# Altium schematic sheet RP2040_Evaluation_Connectors.SchDoc: RP2040 Evaluation Board
size B; Date: 6/27/21; Author: Robert Pafford; Organization: ORGANIZATION; Address1: ADDRESS 1; Address2: ADDRESS 2; Address3: ADDRESS 3; Address4: ADDRESS 4; Revision: -; SheetNumber: 2; SheetTotal: 3; ENG_APP_DATE: --/--/--; DSN_APP_DATE: --/--/--; CHK_APP_DATE: --/--/--
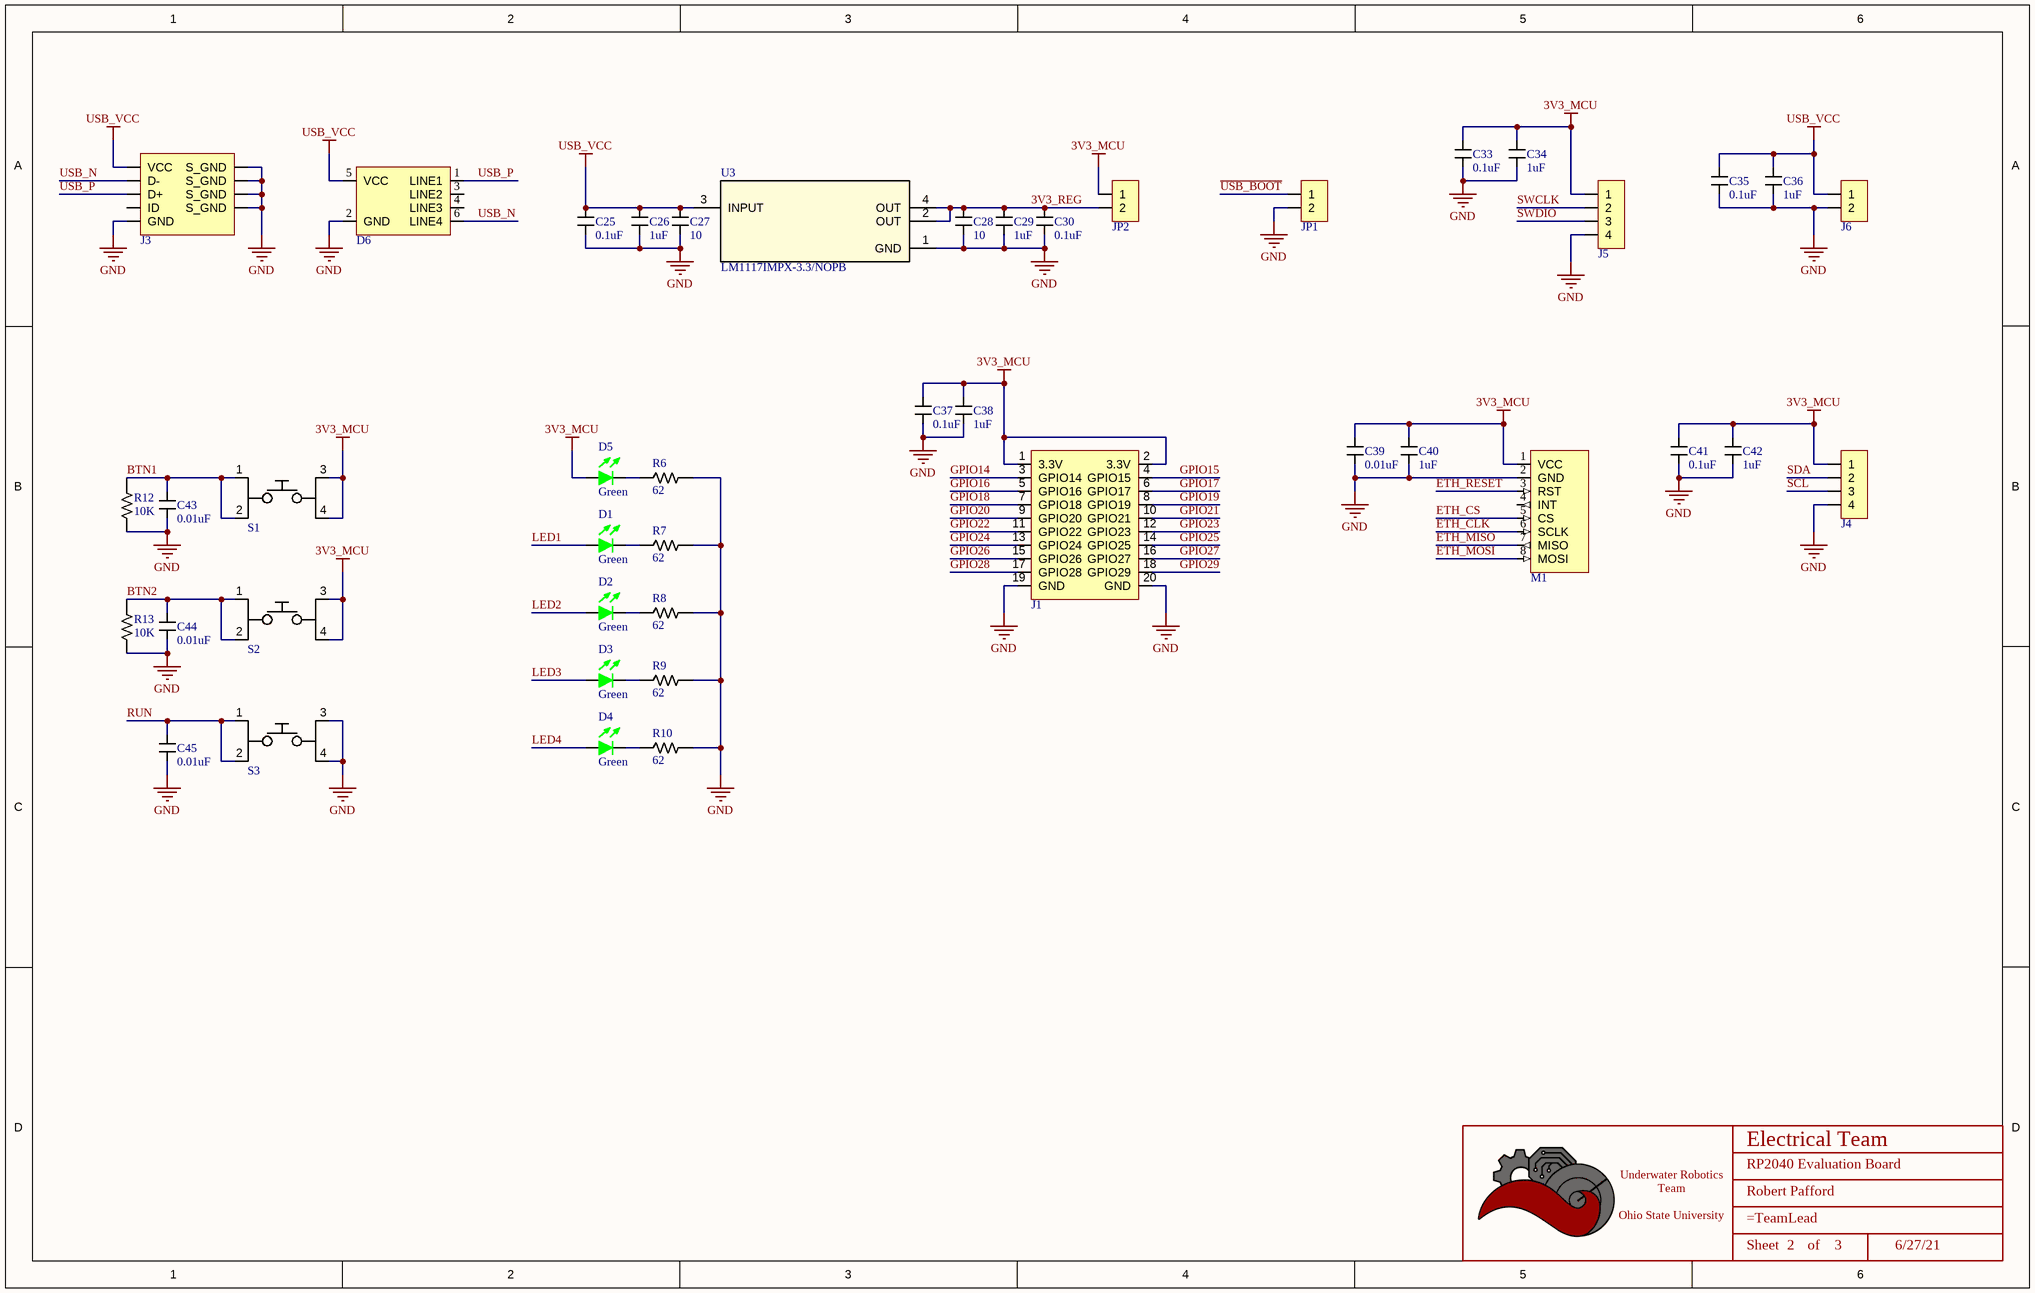
[diagram p0: RP2040_Evaluation_Connectors.SchDoc]

## Parts
*  Title_Block  (value not drawn)  (graphical)
C25  value 0.1uF  [CAPACITOR_0603]  (hidden comment: 100nF Ceramic 6.3V)
C26  value 1uF  [CAPACITOR_0603]  (hidden comment: 1uF Ceramic 16V)
C27  Value (uF): 10  [CAPACITOR_0603]  (hidden comment: 10uF Ceramic 6.3V)
C28  Value (uF): 10  [CAPACITOR_0603]  (hidden comment: 10uF Ceramic 6.3V)
C29  value 1uF  [CAPACITOR_0603]  (hidden comment: 1uF Ceramic 16V)
C30  value 0.1uF  [CAPACITOR_0603]  (hidden comment: 100nF Ceramic 6.3V)
C33  value 0.1uF  [CAPACITOR_0603]  (hidden comment: 100nF Ceramic 6.3V)
C34  value 1uF  [CAPACITOR_0603]  (hidden comment: 1uF Ceramic 16V)
C35  value 0.1uF  [CAPACITOR_0603]  (hidden comment: 100nF Ceramic 6.3V)
C36  value 1uF  [CAPACITOR_0603]  (hidden comment: 1uF Ceramic 16V)
C37  value 0.1uF  [CAPACITOR_0603]  (hidden comment: 100nF Ceramic 6.3V)
C38  value 1uF  [CAPACITOR_0603]  (hidden comment: 1uF Ceramic 16V)
C39  value 0.01uF  [CAPACITOR_0603]  (hidden comment: 10nF Ceramic 6.3V)
C40  value 1uF  [CAPACITOR_0603]  (hidden comment: 1uF Ceramic 16V)
C41  value 0.1uF  [CAPACITOR_0603]  (hidden comment: 100nF Ceramic 6.3V)
C42  value 1uF  [CAPACITOR_0603]  (hidden comment: 1uF Ceramic 16V)
C43  value 0.01uF  [CAPACITOR_0603]  (hidden comment: 10nF Ceramic 6.3V)
C44  value 0.01uF  [CAPACITOR_0603]  (hidden comment: 10nF Ceramic 6.3V)
C45  value 0.01uF  [CAPACITOR_0603]  (hidden comment: 10nF Ceramic 6.3V)
D1  Color: Green  [LED_0603]  (hidden comment: IN-S63AT5G)
D2  Color: Green  [LED_0603]  (hidden comment: IN-S63AT5G)
D3  Color: Green  [LED_0603]  (hidden comment: IN-S63AT5G)
D4  Color: Green  [LED_0603]  (hidden comment: IN-S63AT5G)
D5  Color: Green  [LED_0603]  (hidden comment: IN-S63AT5G)
D6  TVS DIODE 5VWM 25VC SOT23-6  [SOT 23-6L]  (value not drawn)
J1  RP2040 GPIO Header  [HEADER_2x10PIN_2.54MM]  (value not drawn)
J3  USB_MICRO R/A  [CONN_MINIUSB]  (value not drawn)
J4  CONN HEADER VERT 4POS 2.54MM  [HEADER_4PIN_2.54MM]  (value not drawn)
J5  CONN HEADER VERT 4POS 2.54MM  [HEADER_4PIN_2.54MM]  (value not drawn)
J6  2 POS  [HEADER_2PIN_2.54MM]  (value not drawn)
JP1  2 POS  [HEADER_2PIN_2.54MM]  (value not drawn)
JP2  2 POS  [HEADER_2PIN_2.54MM]  (value not drawn)
M1  W5x00 Breakout Board  [W5500IO-P]  (value not drawn)
R6  Value  (Ohms): 62  [RESISTOR_0603]  (hidden comment: 62 Ohm 1% 1/4W)
R7  Value  (Ohms): 62  [RESISTOR_0603]  (hidden comment: 62 Ohm 1% 1/4W)
R8  Value  (Ohms): 62  [RESISTOR_0603]  (hidden comment: 62 Ohm 1% 1/4W)
R9  Value  (Ohms): 62  [RESISTOR_0603]  (hidden comment: 62 Ohm 1% 1/4W)
R10  Value  (Ohms): 62  [RESISTOR_0603]  (hidden comment: 62 Ohm 1% 1/4W)
R12  Value  (Ohms): 10K  [RESISTOR_0603]  (hidden comment: 10k Ohm 5% 1/10W)
R13  Value  (Ohms): 10K  [RESISTOR_0603]  (hidden comment: 10k Ohm 5% 1/10W)
S1  SPST Tactile Switch  [TactileSwitch]  (value not drawn)
S2  SPST Tactile Switch  [TactileSwitch]  (value not drawn)
S3  SPST Tactile Switch  [TactileSwitch]  (value not drawn)
U3  LM1117IMPX-3.3/NOPB  [SOT-223-4]

## Nets
3V3_MCU: C33.1 C34.1 C37.1 C38.1 C39.1 C40.1 C41.1 C42.1 D5.1 J1.1(3.3V) J1.2(3.3V) J4.1 J5.1 JP2.1 M1.1(VCC) S1.3 S1.4 S2.3 S2.4
GND: C25.2 C26.2 C27.2 C28.2 C29.2 C30.2 C33.2 C34.2 C35.2 C36.1 C37.2 C38.2 C39.2 C40.2 C41.2 C42.2 C43.2 C44.2 C45.2 D6.2(GND) J1.19(GND) J1.20(GND) J3.5(GND) J3.6(S_GND) J3.7(S_GND) J3.8(S_GND) J3.9(S_GND) J4.4 J5.4 J6.2 JP1.2 M1.2(GND) R6.1 R7.1 R8.1 R9.1 R10.1 R12.2 R13.2 S3.3 S3.4 U3.1(GND)
USB_VCC: C25.1 C26.1 C27.1 C35.1 C36.2 D6.5(VCC) J3.1(VCC) J6.1 U3.3(INPUT)
3V3_REG: C28.1 C29.1 C30.1 JP2.2 U3.2(OUT) U3.4(OUT)
BTN1: C43.1 R12.1 S1.1 S1.2
BTN2: C44.1 R13.1 S2.1 S2.2
ETH_CLK: M1.6(SCLK)
ETH_CS: M1.5(CS)
ETH_MISO: M1.7(MISO)
ETH_MOSI: M1.8(MOSI)
ETH_RESET: M1.3(RST)
GPIO14: J1.3(GPIO14)
GPIO15: J1.4(GPIO15)
GPIO16: J1.5(GPIO16)
GPIO17: J1.6(GPIO17)
GPIO18: J1.7(GPIO18)
GPIO19: J1.8(GPIO19)
GPIO20: J1.9(GPIO20)
GPIO21: J1.10(GPIO21)
GPIO22: J1.11(GPIO22)
GPIO23: J1.12(GPIO23)
GPIO24: J1.13(GPIO24)
GPIO25: J1.14(GPIO25)
GPIO26: J1.15(GPIO26)
GPIO27: J1.16(GPIO27)
GPIO28: J1.17(GPIO28)
GPIO29: J1.18(GPIO29)
LED1: D1.1
LED2: D2.1
LED3: D3.1
LED4: D4.1
RUN: C45.1 S3.1 S3.2
SCL: J4.3
SDA: J4.2
SWCLK: J5.2
SWDIO: J5.3
~{USB_BOOT}: JP1.1
USB_N: D6.6(LINE4) J3.2(D-)
USB_P: D6.1(LINE1) J3.3(D+)
NetD1_2: D1.2 R7.2
NetD2_2: D2.2 R8.2
NetD3_2: D3.2 R9.2
NetD4_2: D4.2 R10.2
NetD5_2: D5.2 R6.2

Not connected (* = marked no-connect by the designer): D6 3(LINE2) 4(LINE3); J3 4(ID); M1 4(INT)

## Notes on the sheet
- DWG. NO.
- REV.
- SHT.
- THIS DOCUMENT AND THE DATA DISCLOSED HEREIN OR HEREWITH IS THE PROPERTY OF ALTIUM LIMITED AND MAY BE FREELY DISTRIBUTED IN WHOLE. NO RIGHTS ARE RESERVED OR EXPRESS OR IMPLIED WARANTEE GIVEN.
- REVISION
- DESCRIPTION
- DATE
- APPROVED
- ENG:
- APPROVALS
- PROJECT
- DSN:
- CHK:
- REFERENCE DOCUMENTS
- PROJECT REVISION:
- TITLE
- DOCUMENT REVISION:
- DESIGN ITEM:
- BOM:
- FAB DWG:
- PCB DWG:
- ASSY DWG:
- SCALE:
- SIZE
- B
- CAGE CODE
- FILE NAME
- DWG NO.
- SHEET
- OF
- REV
- (in symbol Title_Block) Electrical Team; Underwater Robotics Team / Ohio State University; Sheet; of

## Library data of the parts
* = Title_Block: UWRT Schematic Title Block Template / Created June 2021, Dylan Trainor
C25 C30 C33 C35 C37 C41 = CAPACITOR_0.1uF_0603: Cap 100nF 6.3V +/-10% / Ceramic 0603; Made By: Flip B; ComponentLink1Description: Datsheet; ComponentLink1URL: https://www.mouser.com/datasheet/2/212/KEM_C1002_X7R_SMD-1102033.pdf; Tolerance: +/- 10%; Voltage: 6.3V; Supplier 1: Digi-Key; Supplier Part Number 1: 399-15351-1-ND
C26 C29 C34 C36 C38 C40 C42 = CAPACITOR_1uF_0603: Cap 1uF 16V +/-10% / Ceramic 0603; Made By: Flip B; Tolerance: +/- 10%; Voltage: 16V; Supplier 1: Digi-Key; Supplier Part Number 1: 399-7847-1-ND
C27 C28 = CAPACITOR_10uF_0603: Cap 10uF 6.3V +/-20% / Ceramic 0603; Made By: Flip B; ComponentLink1Description: Digikey; ComponentLink1URL: https://www.digikey.com/en/products/detail/samsung-electro-mechanics/CL10A106MQ8NNNC/3886777; Supplier 1: Digi-Key; Supplier Part Number 1: 1276-1119-1-ND; Tolerance: +/- 20%; Voltage: 6.3V
C39 C43-C45 = CAPACITOR_0.01uF_0603: Cap 10nF 6.3V +/-20% / Ceramic 0603; Tolerance: +/- 10%; Made By: Flip B; ComponentLink1Description: Datsheet; ComponentLink1URL: https://www.mouser.com/datasheet/2/212/KEM_C1002_X7R_SMD-1102033.pdf; Voltage: 6.3V; Supplier 1: Mouser; Supplier Part Number 1: 80-C0603C103K9R
D1-D5 = LED_Green_0603_3V: LED Green Vf= 3V If = 0.005A / IN-S63AT5G; Made By: Robert Pafford; Forward Current: 5mA; ComponentLink1Description: Datasheet; ComponentLink1URL: https://www.we-online.de/katalog/datasheet/150060GS75000.pdf; Forward Voltage: 3V; Package: 0603; Supplier 1: Digi-Key; Supplier Part Number 1: 1830-1062-1-ND
D6 = RCLAMP0504S.TCT: 25V Clamp 6A (8/20µs) Ipp Tvs Diode Surface Mount SOT-23-6; Made By: Robert Pafford; Reverse Standoff Voltage (Typ): 5V; Breakdown Voltage (Min): 6V; Supplier 1: Digi-Key; Supplier Part Number 1: RCLAMP0504SCT-ND; Clamping Voltage (Max): 25V
J1 = HEADER_2x10PIN_2.54MM_RP2040_GPIO: CONN HEADER VERT 20POS 2.54MM; Made By: Robert Pafford; Supplier 1: Digi-Key; Supplier Part Number 1: Z8747-ND
J3 = CONN_MICROUSB: Amphenol Micro USB-B / USB2.0 5 Pin Right Angle SMD; Pitch: 0.65mm; Current Per Pin: 1.8A; Number of Positions: 5; Manufacturer: Amphenol; Configuration: Right Angle; Color: Silver; Created By: Flip B; ComponentLink1Description: Datasheet; ComponentLink1URL: https://cdn.amphenol-icc.com/media/wysiwyg/files/documentation/datasheet/inputoutput/io_usb_micro.pdf?__cf_chl_jschl_tk__=05693735e19256298f6ef6ca2bb2e65c376a4f56-1625503833-0-Abitsb0-ufjOXJYs_S3J3r2iTn-nObalbmXUksF1VvO_h_WEmRdMlUD1I8-hmWSEVWzY1pirKnrPZWfgY3851qyBZe5ZvnNQePLGIzUgdEIQBVUyW36RsbYpDLEWxJ4horD-5gChFgobLYqwmG5aHl0E8lIn_twwPPrOxilK2gP0q9t_CNOs_u5fMqXvXUrlsOv8tIE2NRlu6NVP8qtkL2GjhlkeTUbDMF8WvvpPDTFOgvZ4Y16Ej8F8AhWos88mo5B1HssXozw0XrkJQIqERITUu6rqloz9kf4ZzhBHtDAt-IkiAFY_Ds9SW8FYKKTtINJVpHZQ6Gyu1FFM4Dc9MO0maE8_mmNcwlxqyRoRk_MPWW8VyByXWM5RSp52jteRKw7FeI9WIYvCbPAOy0Eyib-aseIQsnGbglBcUY6_2xp8GYaJM38H3dNvBPsSOfJBPndKedwKHllxjkucXn6xsN0sDXkpGN-cu8_2bDTJ0g-uUucKSCooYX-ApSDNGpkA_p9zv1SOAD8c0zaZVmtiBsN75QpVz2rzq9_BFxOywPvR; Series: 10118192; Supplier 1: Digi-Key; Supplier Part Number 1: 609-4613-1-ND
J4 J5 = HEADER_4PIN_2.54MM: Made By: Robert Pafford; Supplier 1: Digi-Key; Supplier Part Number 1: S1012E-04-ND
J6 JP1 JP2 = HEADER_2PIN_2.54MM: CONN HEADER VERT 2POS 2.54MM; Configuration: Vertical; Current Per Pin: 1A; Number of Positions: 2; Manufacturer: *; Pitch: 2.54mm; Color: Natural; Created By: Robert P; ComponentLink1Description: Datasheet; ComponentLink1URL: https://www.molex.com/pdm_docs/sd/026013115_sd.pdf; Series: *; Supplier 1: Digi-Key; Supplier Part Number 1: A121480-ND; Supplier 2: Mouser; Supplier Part Number 2: 571-5-146280-2
M1 = W5500IO-P: W5x00 Breakout Board (W5500IO-P Compatible boards); Made By: Robert Pafford; Voltage: 3.3V; ComponentLink1Description: Product Webpage; ComponentLink1URL: https://maker.wiznet.io/2019/04/02/w5500io-p/
R6-R10 = RESISTOR_62_0603: RES SMD 62 OHM 1% 1/4W 0603; Tolerance: +/- 1%; Made By: Robert Pafford; ComponentLink1Description: Datasheet; ComponentLink1URL: https://www.bourns.com/docs/product-datasheets/CRxxxxx.pdf; Wattage: 1/4W; Supplier: Digikey; Digikey Part Numer: CR0603-JW-104ELFTR-ND; Supplier 1: Digi-Key; Supplier Part Number 1: 541-RCS060362R0FKEACT-ND
R12 R13 = RESISTOR_10K_0603: RES 10k OHM 5% 1/10W 0603; Tolerance: +/- 5%; Wattage: 1/8W; Made By: Robert Pafford; ComponentLink1Description: Datasheet; ComponentLink1URL: https://www.bourns.com/docs/product-datasheets/CRxxxxx.pdf; Supplier: Digikey; Digikey Part Numer: CR0603-JW-104ELFTR-ND; Supplier 1: Digi-Key; Supplier Part Number 1: 2019-RK73B1JTTD103JCT-ND
S1-S3 = Tactile Switch: SWITCH TACTILE SPST-NO 0.05A 12V; Made By: Robert Pafford; Supplier 1: Digi-Key; Supplier Part Number 1: EG2494-ND
U3 = LM1117IMPX-3.3/NOPB: IC REG LIN 3.3V 800MA SOT223-4; PartNumber: LM1117IMP-3.3/NOPB; Manufacturer: Texas Instruments; Vin (Max): 15V; Supplier 1: Digi-Key; Supplier Part Number 1: LM1117IMPX-3.3/NOPBCT-ND; Vout (Min/Fixed): 3.3V; Amp Out: 800mA; Package: SOT-223-4; Created By: Dylan T